# Altium schematic sheet Ryu-Bottom.SchDoc
size A4; SheetNumber: 1; SheetTotal: 1
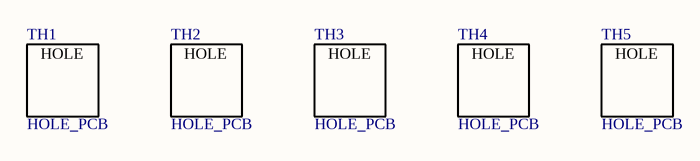
[diagram p0: Ryu-Bottom.SchDoc]

## Parts
TH1  HOLE_PCB  [M2_PCB_HOLE]
TH2  HOLE_PCB  [M2_PCB_HOLE]
TH3  HOLE_PCB  [M2_PCB_HOLE]
TH4  HOLE_PCB  [M2_PCB_HOLE]
TH5  HOLE_PCB  [M2_PCB_HOLE]

## Notes on the sheet
- (in symbol HOLE_PCB) HOLE